# Altium project Time_Sampling_Oscilloscope.PrjPcb
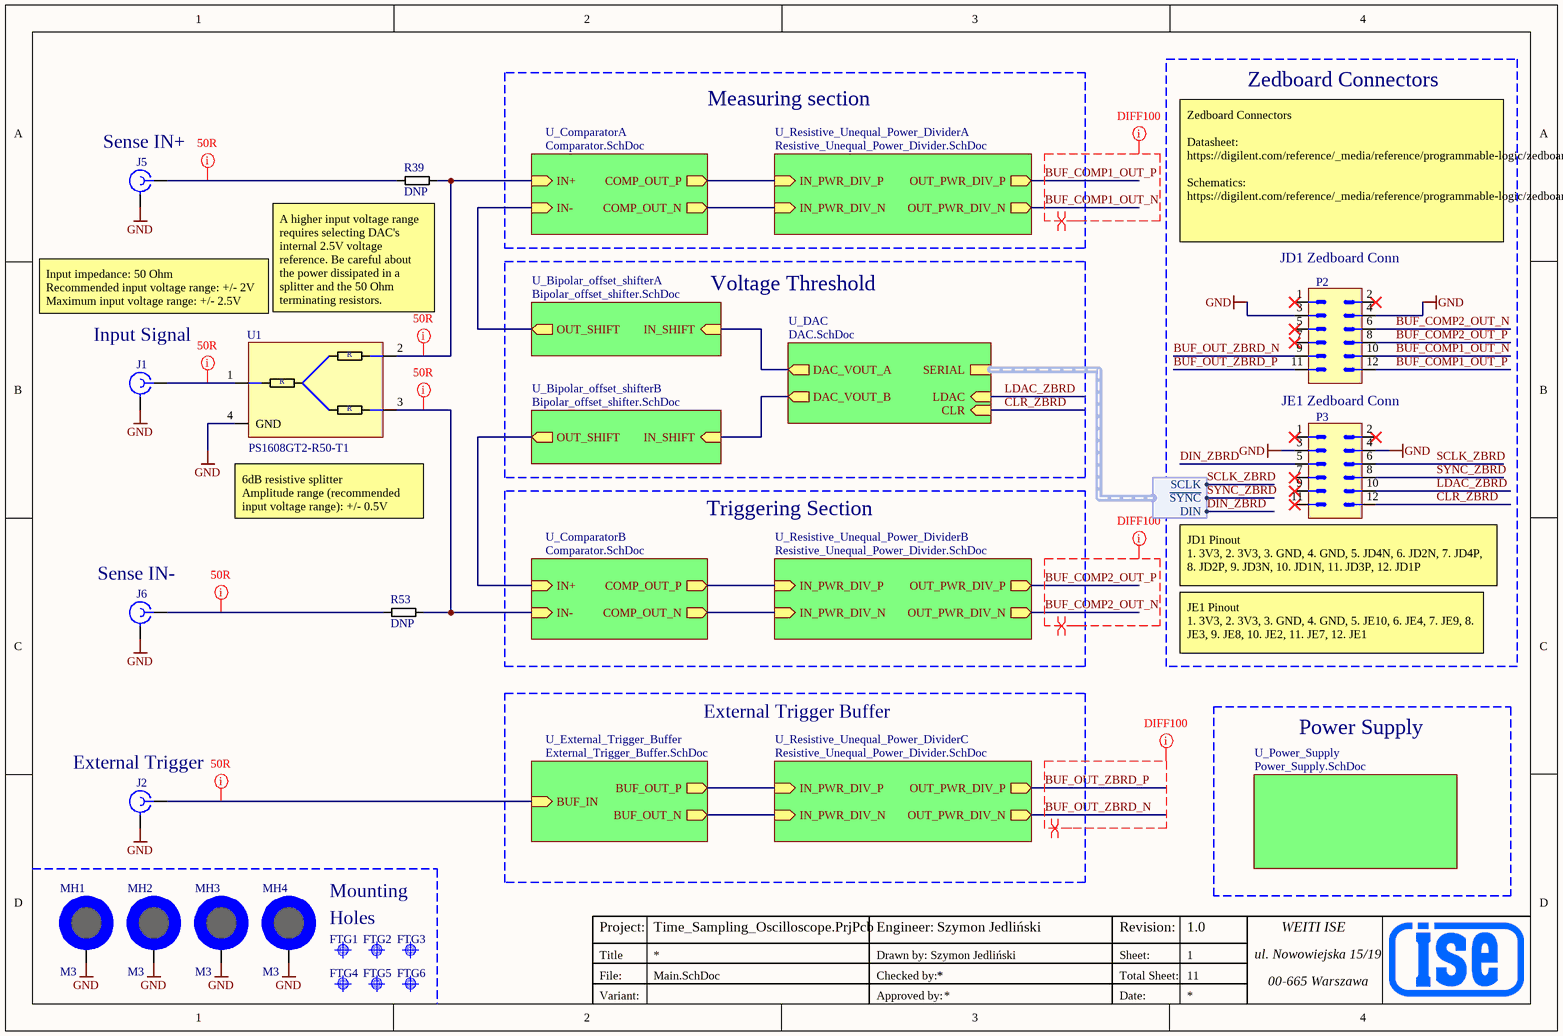
[diagram p0: Main.SchDoc]
11 sheets, 225 parts. Net scope: hierarchical (ports join the sheet entries above them; power ports are global).
Board file: PCB.PcbDoc
Sheets:
  Main.SchDoc
    U_ComparatorA = Comparator.SchDoc
    U_ComparatorB = Comparator.SchDoc
    U_Power_Supply = Power_Supply.SchDoc
      U_Power_P2V5 = Power_P2V5.SchDoc
      U_Power_N2V5 = Power_N2V5.SchDoc
      U_Power_P3V3 = Power_P3V3.SchDoc
      U_Power_VREF_P1V25 = Power_VREF_P1V25.SchDoc
    U_DAC = DAC.SchDoc
    U_External_Trigger_Buffer = External_Trigger_Buffer.SchDoc
    U_Bipolar_offset_shifterA = Bipolar_Offset_Shifter.SchDoc
    U_Bipolar_offset_shifterB = Bipolar_Offset_Shifter.SchDoc
    U_Resistive_Unequal_Power_DividerB = Resistive_Unequal_Power_Divider.SchDoc
    U_Resistive_Unequal_Power_DividerA = Resistive_Unequal_Power_Divider.SchDoc
    U_Resistive_Unequal_Power_DividerC = Resistive_Unequal_Power_Divider.SchDoc

## Sheet Main.SchDoc
size A4; CompanyName: WEITI ISE; Address1: ul. Nowowiejska 15/19; Address2: 00-665 Warszawa; DocumentNumber: 1; SheetNumber: 1; SheetTotal: 11

### Parts
FTG1  Fiducial  [FIDUCIAL_TOP_S100-200]  (value not drawn)  (no BOM)
FTG2  Fiducial  [FIDUCIAL_TOP_S100-200]  (value not drawn)  (no BOM)
FTG3  Fiducial  [FIDUCIAL_TOP_S100-200]  (value not drawn)  (no BOM)
FTG4  Fiducial  [FIDUCIAL_BOT_S100-200]  (value not drawn)  (no BOM)
FTG5  Fiducial  [FIDUCIAL_BOT_S100-200]  (value not drawn)  (no BOM)
FTG6  Fiducial  [FIDUCIAL_BOT_S100-200]  (value not drawn)  (no BOM)
J1  CONSMA020.062-G  [CONSMA020.062-G]  (value not drawn)
J2  CONSMA020.062-G  [CONSMA020.062-G]  (value not drawn)
J5  CONSMA020.062-G  [CONSMA020.062-G]  (value not drawn)
J6  CONSMA020.062-G  [CONSMA020.062-G]  (value not drawn)
MH1  M3  [MH-M3_COPPER]  (no BOM)
MH2  M3  [MH-M3_COPPER]  (no BOM)
MH3  M3  [MH-M3_COPPER]  (no BOM)
MH4  M3  [MH-M3_COPPER]  (no BOM)
P2  WURTH_610112249121  [WURTH_610112249121]  (value not drawn)
P3  WURTH_610112249121  [WURTH_610112249121]  (value not drawn)
R39  DNP  [RESC0402X40N]
R53  DNP  [RESC0402X40N]
U1  PS1608GT2-R50-T1  [PS1608GT2R50T1]

### Blocks framed on the sheet
Zedboard Connectors: P2 P3

### Sub-sheets
U_Bipolar_offset_shifterA = Bipolar_offset_shifter.SchDoc: OUT_SHIFT (out), IN_SHIFT (in)
U_Bipolar_offset_shifterB = Bipolar_offset_shifter.SchDoc: OUT_SHIFT (out), IN_SHIFT (in)
U_ComparatorA = Comparator.SchDoc: IN+ (in), IN- (in), COMP_OUT_P (out), COMP_OUT_N (out)
U_ComparatorB = Comparator.SchDoc: IN- (in), IN+ (in), COMP_OUT_P (out), COMP_OUT_N (out)
U_DAC = DAC.SchDoc: SERIAL (harness SERIAL_DAC), LDAC (in), CLR (in), DAC_VOUT_A (out), DAC_VOUT_B (out)
U_External_Trigger_Buffer = External_Trigger_Buffer.SchDoc: BUF_IN (in), BUF_OUT_P (out), BUF_OUT_N (out)
U_Power_Supply = Power_Supply.SchDoc: no entries
U_Resistive_Unequal_Power_DividerA = Resistive_Unequal_Power_Divider.SchDoc: IN_PWR_DIV_P (in), OUT_PWR_DIV_P (out), IN_PWR_DIV_N (in), OUT_PWR_DIV_N (out)
U_Resistive_Unequal_Power_DividerB = Resistive_Unequal_Power_Divider.SchDoc: IN_PWR_DIV_P (in), OUT_PWR_DIV_P (out), IN_PWR_DIV_N (in), OUT_PWR_DIV_N (out)
U_Resistive_Unequal_Power_DividerC = Resistive_Unequal_Power_Divider.SchDoc: IN_PWR_DIV_P (in), OUT_PWR_DIV_P (out), IN_PWR_DIV_N (in), OUT_PWR_DIV_N (out)

### Harnesses
SERIAL_DAC: DIN, SCLK, ~{SYNC}

### Nets
GND: J1.2 J2.2 J5.2 J6.2 MH1.MH MH2.MH MH3.MH MH4.MH P2.3 P2.4 P3.3 P3.4 U1.4(GND)
BUF_COMP1_OUT_N: P2.10 ; sheet U_Resistive_Unequal_Power_DividerA/OUT_PWR_DIV_N
BUF_COMP1_OUT_P: P2.12 ; sheet U_Resistive_Unequal_Power_DividerA/OUT_PWR_DIV_P
BUF_COMP2_OUT_N: P2.6 ; sheet U_Resistive_Unequal_Power_DividerB/OUT_PWR_DIV_N
BUF_COMP2_OUT_P: P2.8 ; sheet U_Resistive_Unequal_Power_DividerB/OUT_PWR_DIV_P
BUF_IN: J2.1 ; sheet U_External_Trigger_Buffer/BUF_IN
BUF_OUT_N: sheet U_External_Trigger_Buffer/BUF_OUT_N, sheet U_Resistive_Unequal_Power_DividerC/IN_PWR_DIV_N
BUF_OUT_P: sheet U_External_Trigger_Buffer/BUF_OUT_P, sheet U_Resistive_Unequal_Power_DividerC/IN_PWR_DIV_P
BUF_OUT_ZBRD_N: P2.9 ; sheet U_Resistive_Unequal_Power_DividerC/OUT_PWR_DIV_N
BUF_OUT_ZBRD_P: P2.11 ; sheet U_Resistive_Unequal_Power_DividerC/OUT_PWR_DIV_P
CLR_ZBRD: P3.12 ; sheet U_DAC/CLR
COMP_OUT_N: sheet U_ComparatorA/COMP_OUT_N, sheet U_Resistive_Unequal_Power_DividerA/IN_PWR_DIV_N
COMP_OUT_N: sheet U_ComparatorB/COMP_OUT_N, sheet U_Resistive_Unequal_Power_DividerB/IN_PWR_DIV_N  [a separate net that carries the same name]
COMP_OUT_P: sheet U_ComparatorA/COMP_OUT_P, sheet U_Resistive_Unequal_Power_DividerA/IN_PWR_DIV_P
COMP_OUT_P: sheet U_ComparatorB/COMP_OUT_P, sheet U_Resistive_Unequal_Power_DividerB/IN_PWR_DIV_P  [a separate net that carries the same name]
DAC_VOUT_A: sheet U_DAC/DAC_VOUT_A, sheet U_Bipolar_offset_shifterA/IN_SHIFT
DAC_VOUT_B: sheet U_DAC/DAC_VOUT_B, sheet U_Bipolar_offset_shifterB/IN_SHIFT
DIN_ZBRD: P3.5 ; sheet U_DAC/SERIAL.DIN
IN+: R39.1 U1.2 ; sheet U_ComparatorA/IN+
IN+: sheet U_ComparatorB/IN+, sheet U_Bipolar_offset_shifterB/OUT_SHIFT  [a separate net that carries the same name]
IN-: R53.2 U1.3 ; sheet U_ComparatorB/IN-
IN-: sheet U_ComparatorA/IN-, sheet U_Bipolar_offset_shifterA/OUT_SHIFT  [a separate net that carries the same name]
LDAC_ZBRD: P3.10 ; sheet U_DAC/LDAC
SCLK_ZBRD: P3.6 ; sheet U_DAC/SERIAL.SCLK
SYNC_ZBRD: P3.8 ; sheet U_DAC/SERIAL.~{SYNC}
NetJ1_1: J1.1 U1.1
NetJ5_1: J5.1 R39.2
NetJ6_1: J6.1 R53.1

Not connected (* = marked no-connect by the designer): P2 1* 2* 5* 7*; P3 1* 2* 7* 9* 11*

### Layout directives
net class SE50; CompClassName: SE50_LINE: BUF_IN, IN+, IN-, NetJ1_1, NetJ5_1, NetJ6_1
mark named DIFF100: BUF_COMP1_OUT_N, BUF_COMP1_OUT_P, BUF_COMP2_OUT_N, BUF_COMP2_OUT_P, BUF_OUT_ZBRD_N, BUF_OUT_ZBRD_P
differential pair; differential pair class DIFF100_LINES; net class DIFF100: BUF_COMP1_OUT_N, BUF_COMP1_OUT_P, BUF_COMP2_OUT_N, BUF_COMP2_OUT_P, BUF_OUT_ZBRD_N, BUF_OUT_ZBRD_P

### Notes on the sheet
- Measuring section
- (near J5) Sense IN+
- Zedboard Connectors
  Datasheet:
  https://digilent.com/reference/_media/reference/programmable-logic/zedboard/zedboard_ug.pdf
  Schematics:
  https://digilent.com/reference/_media/reference/programmable-logic/zedboard/zedboard_sch.pdf
- Input impedance: 50 Ohm
  Recommended input voltage range: +/- 2V
  Maximum input voltage range: +/- 2.5V
- (near R39) A higher input voltage range requires selecting DAC's internal 2.5V voltage reference. Be careful about the power dissipated in a splitter and the 50 Ohm terminating resistors.
- Voltage Threshold
- (near P2) JD1 Zedboard Conn
- Input Signal
- JE1 Zedboard Conn
- (near U1) 6dB resistive splitter
  Amplitude range (recommended input voltage range): +/- 0.5V
- Triggering Section
- (near J6) Sense IN-
- (near P3) JD1 Pinout
  1. 3V3, 2. 3V3, 3. GND, 4. GND, 5. JD4N, 6. JD2N, 7. JD4P, 8. JD2P, 9. JD3N, 10. JD1N, 11. JD3P, 12. JD1P
- JE1 Pinout
  1. 3V3, 2. 3V3, 3. GND, 4. GND, 5. JE10, 6. JE4, 7. JE9, 8. JE3, 9. JE8, 10. JE2, 11. JE7, 12. JE1
- External Trigger Buffer
- (near J2) External Trigger
- Power Supply
- Mounting
- Holes
- Project:
- Title
- File:
- Drawn by:
- Engineer:
- Checked by:
- Szymon Jedliński
- Sheet:
- Revision:
- Total Sheet:
- 1.0
- Variant:
- Approved by:
- Date:
- (in symbol PS1608GT2-R50-T1) R

### Library data of the parts
FTG1-FTG3 = FIDUCIAL_TOP_S100-200: Square Fiducial Target, Top Layer, 1.0mm, Top Solder 2.0mm, Keepout =2.0mm; DesignItemId: FIDUCIAL_TOP_S100-200; Family: Fiducial; Part Description: Square Fiducial Target, Top Layer, 1.0mm, Top Solder 2.0mm, Keepout =2.0mm
FTG4-FTG6 = FIDUCIAL_BOT_S100-200: Square Fiducial Target, Bot Layer, 1.0mm, Bot Solder 2.0mm, Keepout =2.0mm; DesignItemId: FIDUCIAL_BOT_S100-200; Family: Fiducial; Part Description: Square Fiducial Target, Bot Layer, 1.0mm, Bot Solder 2.0mm, Keepout =2.0mm
J1 J2 J5 J6 = CONSMA020.062-G: Coaxial Connectors SMA, Edge Mount, Female Receptacle, 0.062" PCB Mount, Gold; Manufacturer 1 Component Height: 7.92mm; DesignItemId: CONSMA020.062-G; HelpURL: https://www.mouser.pl/datasheet/2/418/9/ENG_DS_L9000279_01_A-3238972.pdf; Manufacturer Part Number: CONSMA020.062-G; SMD: Yes
MH1-MH4 = MH-M3_C: Mounting hole, M3, exposed pad; DesignItemId: MH-M3_C; Family: M3; Part Description: Mounting hole, M3, exposed pad
P2 P3 = WURTH_610112249121: WR-PHD SMT Angled Dual Pin Header, 2.54mm, 2x6; Manufacturer 1 Component Height: 5.23mm; DesignItemId: WURTH_610112249121; HelpURL: https://www.we-online.com/components/products/datasheet/610112249121.pdf; Manufacturer Part Number: WURTH_610112249121; SMD: Yes
R39 R53 = R0402_DNP: General Purpose Thick Film Chip Resistor; Manufacturer 1 Component Height: 0.4mm; Voltage: 50V; DesignItemId: R0402_DNP; HelpURL: https://www.vishay.com/docs/20035/dcrcwe3.pdf; SMD: Yes; Value: DNP
U1 = PS1608GT2-R50-T1: Signal Conditioning 50 ohm 2 terminal Power Splitter; Manufacturer 1 Component Height: 0.5mm; DesignItemId: PS1608GT2-R50-T1; HelpURL: https://www.mouser.pl/datasheet/2/392/n_catalog_partition31_en-1660522.pdf; Manufacturer Part Number: PS1608GT2-R50-T1; SMD: Yes; Value: PS1608GT2-R50-T1

## Sheet Comparator.SchDoc
size A4; CompanyName: WEITI ISE; Address1: ul. Nowowiejska 15/19; Address2: 00-665 Warszawa; DocumentNumber: 2; SheetNumber: 2; SheetTotal: 11
Used 2 times, as channels U_ComparatorA, U_ComparatorB. Parts and nets are listed once, with the designators drawn on the sheet.
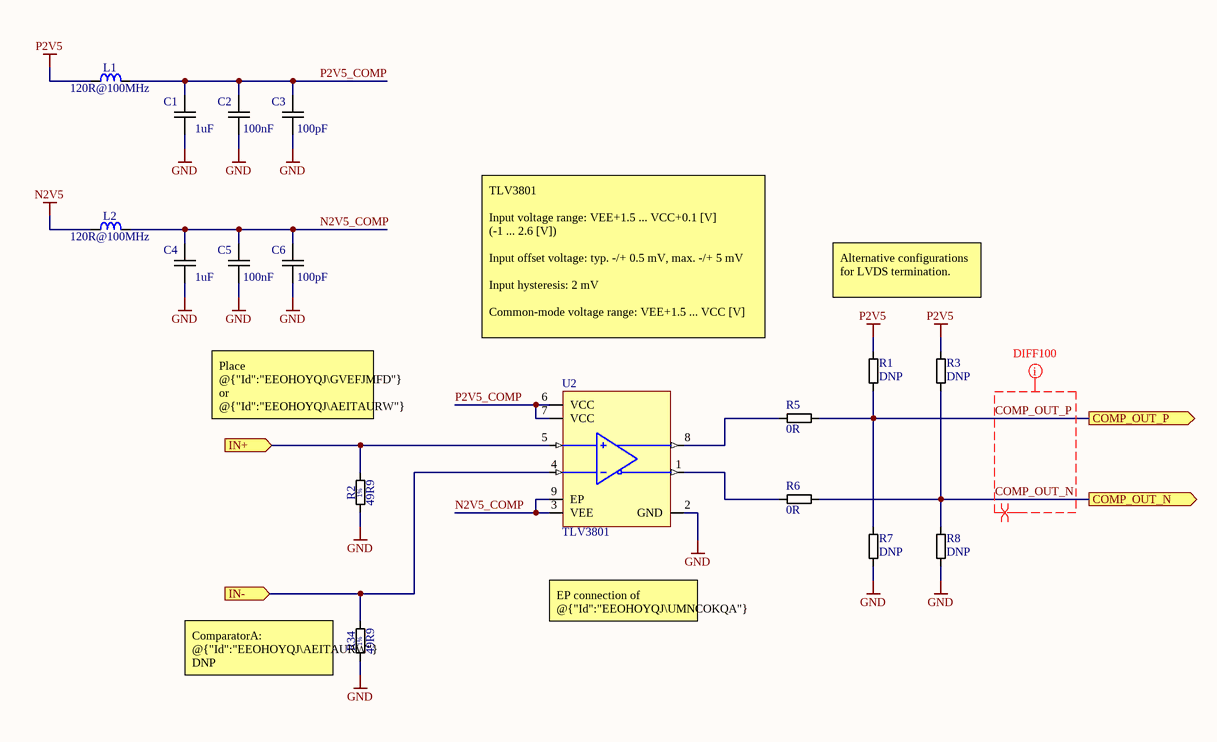
[diagram p1: Comparator.SchDoc]

### Parts
C1  1uF  [CAPC0603X90N]
C2  100nF  [CAPC0603X90N]
C3  100pF  [CAPC0603X90N]
C4  1uF  [CAPC0603X90N]
C5  100nF  [CAPC0603X90N]
C6  100pF  [CAPC0603X90N]
L1  120R@100MHz  [INDC0603X90N]
L2  120R@100MHz  [INDC0603X90N]
R1  DNP  [RESC0402X40N]
R2  49R9  [RESC0402X40N]
R3  DNP  [RESC0402X40N]
R5  0R  [RESC0402X40N]
R6  0R  [RESC0402X40N]
R7  DNP  [RESC0402X40N]
R8  DNP  [RESC0402X40N]
R34  49R9  [RESC0402X40N]
U2  TLV3801  [WSON50P200X200X80-9N]

### Ports
COMP_OUT_N (out), COMP_OUT_P (out), IN+ (in), IN- (in)

### Nets
GND: C1.2 C2.2 C3.2 C4.2 C5.2 C6.2 R2.1 R7.1 R8.1 R34.1 U2.2(GND)
N2V5: L2.1
P2V5: L1.1 R1.2 R3.2
COMP_OUT_N: R3.1 R6.2 R8.2 ; port COMP_OUT_N
COMP_OUT_P: R1.1 R5.2 R7.2 ; port COMP_OUT_P
IN+: R2.2 U2.5(IN+) ; port IN+
IN-: R34.2 U2.4(IN-) ; port IN-
N2V5_COMP: C4.1 C5.1 C6.1 L2.2 U2.3(VEE) U2.9(EP)
P2V5_COMP: C1.1 C2.1 C3.1 L1.2 U2.6(VCC) U2.7(VCC)
NetR5_1: R5.1 U2.8(OUT+)
NetR6_1: R6.1 U2.1(OUT-)

### Channels
U_ComparatorA: designators end in _1; ports COMP_OUT_N=COMP_OUT_N COMP_OUT_P=COMP_OUT_P IN+=IN+ IN-=IN-
U_ComparatorB: designators end in _2; ports COMP_OUT_N=COMP_OUT_N COMP_OUT_P=COMP_OUT_P IN+=IN+ IN-=IN-

### Layout directives
mark named DIFF100: COMP_OUT_N, COMP_OUT_P
differential pair; differential pair class DIFF100_LINES; net class DIFF100: COMP_OUT_N, COMP_OUT_P

### Notes on the sheet
- TLV3801
  Input voltage range: VEE+1.5 ... VCC+0.1 [V]
  (-1 ... 2.6 [V])
  Input offset voltage: typ. -/+ 0.5 mV, max. -/+ 5 mV
  Input hysteresis: 2 mV
  Common-mode voltage range: VEE+1.5 ... VCC [V]
- Alternative configurations for LVDS termination.
- Place @{"Id":"EEOHOYQJ\GVEFJMFD"} or @{"Id":"EEOHOYQJ\AEITAURW"} resistors as close as possible to the input pin of TLV3801
- (near R34) ComparatorA: @{"Id":"EEOHOYQJ\AEITAURW"} DNP
  ComparatorB: @{"Id":"EEOHOYQJ\GVEFJMFD"} DNP
- EP connection of @{"Id":"EEOHOYQJ\UMNCOKQA"} verified with TI support.
- Project:
- Title
- File:
- Drawn by:
- Engineer:
- Checked by:
- Szymon Jedliński
- Sheet:
- Revision:
- Total Sheet:
- 1.0
- Variant:
- Approved by:
- Date:

### Library data of the parts
C1 C4 = CC0603_1UF_16V_10%_X7R: Non-polarised capacitor; Manufacturer Part Number: CL10B105KO8NNNC; DesignItemId: CC0603_1UF_16V_10%_X7R; HelpURL: https://www.mouser.pl/datasheet/2/585/MLCC-1837944.pdf; Height: 0.8mm; SMD: Yes; Value: 1uF
C2 C5 = CC0603_100NF_16V_10%_X7R: Non-polarised capacitor; Manufacturer Part Number: VJ0603Y104KXJCW1BC; DesignItemId: CC0603_100NF_16V_10%_X7R; HelpURL: https://www.vishay.com/docs/28548/vjw1bcbascomseries.pdf; Height: 0.8mm; SMD: Yes; Value: 100nF
C3 C6 = CC0603_100PF_50V_5%_X7R: Non-polarised capacitor; Manufacturer Part Number: 06035C101JAT2A; DesignItemId: CC0603_100PF_50V_5%_X7R; HelpURL: https://www.mouser.pl/datasheet/2/40/KGM_X7R-3223212.pdf; Height: 0.8mm; SMD: Yes; Value: 100pF
L1 L2 = FB0603_120R@100MHZ_2A: Ferrite Bead; Manufacturer Part Number: BLM18PG121SN1D; Manufacturer 1 Component Height: 0.8mm; Tolerance: 25%; DesignItemId: FB0603_120R@100MHZ_2A; HelpURL: https://www.tme.eu/Document/19a35c43258593752611d1c31a7dbf1a/MURATA-BLM18P.pdf; SMD: Yes; Value: 120R@100MHz
R1 R3 R7 R8 = R0402_DNP: as R39 on sheet Main; DesignItemId: R0402_DNP; HelpURL: https://www.vishay.com/docs/20035/dcrcwe3.pdf; SMD: Yes; Value: DNP
R2 R34 = R0402_49R9_0.0625W_100PPM: General Purpose Thick Film Chip Resistor; Manufacturer Part Number: RC0402FR-0749R9L; Manufacturer 1 Component Height: 0.4mm; Tolerance: 1%; Voltage: 50V; DesignItemId: R0402_49R9_0.0625W_100PPM; HelpURL: https://www.mouser.pl/datasheet/2/447/PYu_RC_Group_51_RoHS_L_11-1984063.pdf; SMD: Yes; Value: 49R9
R5 R6 = R0402_0R_JUMPER: General Purpose Thick Film Chip Resistor; Manufacturer Part Number: CRCW04020000Z0EDC; Manufacturer 1 Component Height: 0.4mm; Tolerance: 20mOhm; Voltage: 50V; DesignItemId: R0402_0R_JUMPER; HelpURL: https://www.vishay.com/docs/20035/dcrcwe3.pdf; SMD: Yes; Value: 0R
U2 = TLV3801: 225-ps High-Speed Comparator with LVDS Outputs; Manufacturer Part Number: TLV3801DSG(_); Manufacturer 1 Component Height: 0.8mm; Supplier 1: Mouser; Supplier Part Number 1: 595-TLV3801DSGR; Supplier 2: Mouser; Supplier Part Number 2: 595-TLV3801DSGT; DesignItemId: TLV3801; Device: TLV3801; HelpURL: https://www.ti.com/lit/ds/symlink/tlv3801.pdf?ts=1690237794912; SMD: Yes

## Sheet Power_Supply.SchDoc
size A4; CompanyName: WEITI ISE; Address1: ul. Nowowiejska 15/19; Address2: 00-665 Warszawa; DocumentNumber: 7; SheetNumber: 7; SheetTotal: 11
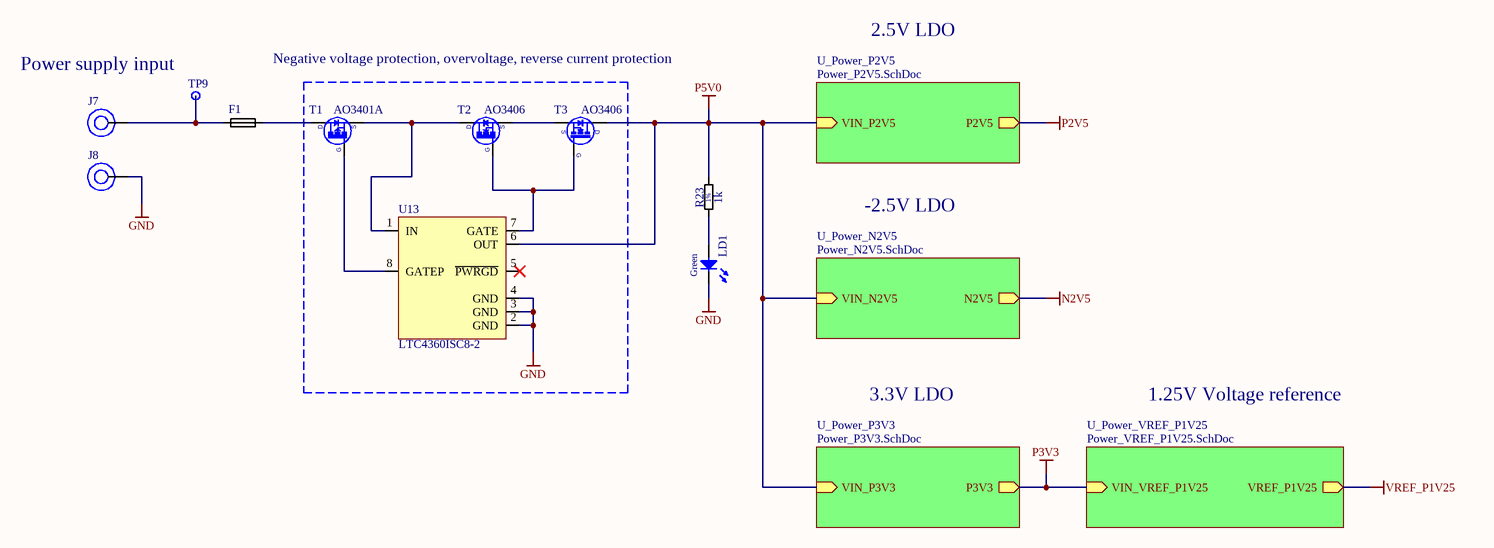
[diagram p2: Power_Supply.SchDoc]

### Parts
F1  C1Q 1.5  [FUSE1206]  (value not drawn)
J7  571-0500  [5710500-Deltron]  (value not drawn)
J8  571-0100  [5710100-Deltron]  (value not drawn)
LD1  Green  [LED_0603X60N]
R23  1k  [RESC0603X60N]
T1  AO3401A  [SOT23-3]
T2  AO3406  [SOT23-3]
T3  AO3406  [SOT23-3]
TP9  TestPoint  [TESTPOINT_SMD_C1P27MM]  (value not drawn)  (no BOM)
U13  LTC4360ISC8-2  [SC70-8]

### Sub-sheets
U_Power_N2V5 = Power_N2V5.SchDoc: N2V5 (out), VIN_N2V5 (in)
U_Power_P2V5 = Power_P2V5.SchDoc: P2V5 (out), VIN_P2V5 (in)
U_Power_P3V3 = Power_P3V3.SchDoc: P3V3 (out), VIN_P3V3 (in)
U_Power_VREF_P1V25 = Power_VREF_P1V25.SchDoc: VREF_P1V25 (out), VIN_VREF_P1V25 (in)

### Nets
GND: J8.1 LD1.1(C) U13.2(GND) U13.3(GND) U13.4(GND)
P3V3: sheet U_Power_P3V3/P3V3, sheet U_Power_VREF_P1V25/VIN_VREF_P1V25
P5V0: R23.2 T3.3(D) U13.6(OUT) ; sheet U_Power_P2V5/VIN_P2V5, sheet U_Power_N2V5/VIN_N2V5, sheet U_Power_P3V3/VIN_P3V3
NetF1_1: F1.1 J7.1 TP9.1
NetF1_2: F1.2 T1.3(D)
NetLD1_2: LD1.2(A) R23.1
NetT1_1: T1.1(G) U13.8(GATEP)
NetT1_2: T1.2(S) T2.3(D) U13.1(IN)
NetT2_1: T2.1(G) T3.1(G) U13.7(GATE)
NetT2_2: T2.2(S) T3.2(S)

Not connected (* = marked no-connect by the designer): U13 5(~{PWRGD})*

### Notes on the sheet
- 2.5V LDO
- (near TP9) Power supply input
- Negative voltage protection, overvoltage, reverse current protection
- -2.5V LDO
- 3.3V LDO
- 1.25V Voltage reference
- Project:
- Title
- File:
- Drawn by:
- Engineer:
- Checked by:
- Szymon Jedliński
- Sheet:
- Revision:
- Total Sheet:
- 1.0
- Variant:
- Approved by:
- Date:

### Library data of the parts
F1 = C1Q 1: Fuse; Very Fast Acting; 1.5A; 125VAC, 63VDC; SMD;; Manufacturer 1 Component Height: 0.58mm; Voltage_rating: 125VAC/63VDC; Fuse type: Ceramic; Breaking capacity: 50A; Current_rating: 1.5A; DesignItemId: C1Q 1; Device: C1Q 1.5; HelpURL: https://www.mouser.pl/datasheet/2/643/ds-CP-c1q-series-1313102.pdf; Manufacturer Part Number: C1Q 1.5; SMD: Yes
J7 = 571-0500: 4mm Jack 90deg PCB Mounted Insulated Socket Red; Manufacturer 1 Component Height: 12.4mm; DesignItemId: 571-0500; Footprint: 571-0500; HelpURL: https://www.mouser.pl/datasheet/2/458/deltron-571-0500-4mm-90deg-single-socket-data-372654.pdf; Manufacturer Part Number: 571-0500; SMD: No
J8 = 571-0100: 4mm Jack 90deg PCB Mounted Insulated Socket Black; Manufacturer 1 Component Height: 12.4mm; DesignItemId: 571-0100; Footprint: 571-0100; HelpURL: https://www.mouser.pl/datasheet/2/458/deltron-571-0500-4mm-90deg-single-socket-data-372654.pdf; Manufacturer Part Number: 571-0100; SMD: No
LD1 = LED_0603_V_GREEN: SMD mono-color Chip LED, Green, 0603; Manufacturer Part Number: HSME-C191; Manufacturer 1 Component Height: 0.6mm; DesignItemId: LED_0603_V_GREEN; Color: Green; HelpURL: https://www.tme.eu/Document/898384df4a59fb78dfee2d27c6573b7a/HSME-C191.pdf; SMD: Yes
R23 = R0603_1K_0.1W_100PPM: General Purpose Thick Film Chip Resistor; Manufacturer Part Number: CQ03SAF1001T5E; Manufacturer 1 Component Height: 0.5mm; Tolerance: 1%; Voltage: 75V; DesignItemId: R0603_1K_0.1W_100PPM; SMD: Yes; Value: 1k
T1 = AO3401A: 30V P-Channel MOSFET; Manufacturer 1 Component Height: 1.05mm; DesignItemId: AO3401A; Device: AO3401A; HelpURL: https://www.tme.eu/Document/d25b071532a0a1e329733a03427696ee/AO3401A-DTE.pdf; Manufacturer Part Number: AO3401A; SMD: Yes
T2 T3 = AO3406: Transistor: N-MOSFET; unipolar; 30V; 2.9A; 0.9W; SOT23; Manufacturer 1 Component Height: 1.05mm; DesignItemId: AO3406; Device: AO3406; HelpURL: https://www.tme.eu/Document/0f7dd37f1878b91445c27729186942d7/AO3406.pdf; Manufacturer Part Number: AO3406; SMD: Yes
TP9 = TESTPOINT_SMD_C1P27MM: 1.27mm diameter SMD Test Point Area; DesignItemId: TESTPOINT_SMD_C1P27MM; Family: TestPoint; Part Description: 1.27mm diameter SMD Test Point Area
U13 = LTC4360ISC8-2: Overvoltage Protection Controller, 2.5V to 5.5V Operation, Reverse Voltage Protection; Manufacturer Part Number: LTC4360ISC8-2#TRMPBF; Manufacturer 1 Component Height: 1mm; DesignItemId: LTC4360ISC8-2; Device: LTC4360ISC8-2; HelpURL: https://www.analog.com/media/en/technical-documentation/data-sheets/LTC4360-1-4360-2.pdf; SMD: Yes

## Sheet Power_P2V5.SchDoc
size A4; CompanyName: WEITI ISE; Address1: ul. Nowowiejska 15/19; Address2: 00-665 Warszawa; DocumentNumber: 8; SheetNumber: 8; SheetTotal: 11
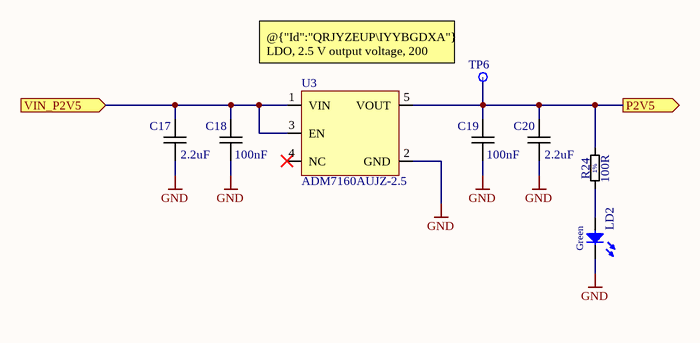
[diagram p3: Power_P2V5.SchDoc]

### Parts
C17  2.2uF  [CAPC0603X90N]
C18  100nF  [CAPC0603X90N]
C19  100nF  [CAPC0603X90N]
C20  2.2uF  [CAPC0603X90N]
LD2  Green  [LED_0603X60N]
R24  100R  [RESC0603X60N]
TP6  TestPoint  [TESTPOINT_SMD_C1P27MM]  (value not drawn)  (no BOM)
U3  ADM7160AUJZ-2.5  [SOT23-5]

### Ports
P2V5 (out), VIN_P2V5 (in)

### Nets
GND: C17.2 C18.2 C19.2 C20.2 LD2.1(C) U3.2(GND)
P2V5: C19.1 C20.1 R24.2 TP6.1 U3.5(VOUT) ; port P2V5
P5V0: C17.1 C18.1 U3.1(VIN) U3.3(EN) ; port VIN_P2V5
NetLD2_2: LD2.2(A) R24.1

Not connected (* = marked no-connect by the designer): U3 4(NC)*

### Notes on the sheet
- @{"Id":"QRJYZEUP\IYYBGDXA"} LDO, 2.5 V output voltage, 200 mA maximum output current
- Project:
- Title
- File:
- Drawn by:
- Engineer:
- Checked by:
- Szymon Jedliński
- Sheet:
- Revision:
- Total Sheet:
- 1.0
- Variant:
- Approved by:
- Date:

### Library data of the parts
C17 C20 = CC0603_2U2F_16V_10%_X7R: Non-polarised capacitor; Manufacturer Part Number: GRM188Z71C225KE43D; DesignItemId: CC0603_2U2F_16V_10%_X7R; HelpURL: https://www.mouser.pl/datasheet/2/281/1/GRM188Z71C225KE43_01A-1985990.pdf; Height: 0.8mm; SMD: Yes; Value: 2.2uF
C18 C19 = CC0603_100NF_16V_10%_X7R: as C2 on sheet Comparator; DesignItemId: CC0603_100NF_16V_10%_X7R; HelpURL: https://www.vishay.com/docs/28548/vjw1bcbascomseries.pdf; Height: 0.8mm; SMD: Yes; Value: 100nF
LD2 = LED_0603_V_GREEN: as LD1 on sheet Power_Supply; DesignItemId: LED_0603_V_GREEN; Color: Green; HelpURL: https://www.tme.eu/Document/898384df4a59fb78dfee2d27c6573b7a/HSME-C191.pdf; SMD: Yes
R24 = R0603_100R_0.1W_100PPM: General Purpose Thick Film Chip Resistor; Manufacturer Part Number: 0603SAF1000T5E; Manufacturer 1 Component Height: 0.5mm; Tolerance: 1%; Voltage: 50V; DesignItemId: R0603_100R_0.1W_100PPM; HelpURL: https://www.vishay.com/docs/20035/dcrcwe3.pdf; SMD: Yes; Value: 100R
TP6 = TESTPOINT_SMD_C1P27MM: 1.27mm diameter SMD Test Point Area; DesignItemId: TESTPOINT_SMD_C1P27MM; Family: TestPoint; Part Description: 1.27mm diameter SMD Test Point Area
U3 = ADM7160AUJZ-2.5: Ultralow Noise, 200 mA Linear Regulator, 2.5V out; Manufacturer 1 Component Height: 1mm; DesignItemId: ADM7160AUJZ-2.5; Device: ADM7160AUJZ-2.5; HelpURL: https://www.mouser.pl/datasheet/2/609/ADM7160-3120776.pdf; SMD: Yes

## Sheet Power_N2V5.SchDoc
size A4; CompanyName: WEITI ISE; Address1: ul. Nowowiejska 15/19; Address2: 00-665 Warszawa; DocumentNumber: 9; SheetNumber: 9; SheetTotal: 11
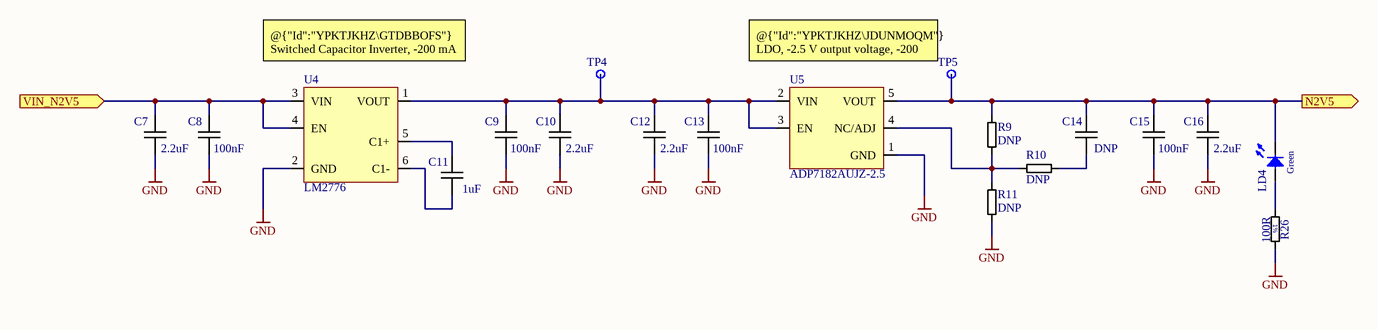
[diagram p4: Power_N2V5.SchDoc]

### Parts
C7  2.2uF  [CAPC0603X90N]
C8  100nF  [CAPC0603X90N]
C9  100nF  [CAPC0603X90N]
C10  2.2uF  [CAPC0603X90N]
C11  1uF  [CAPC0603X90N]
C12  2.2uF  [CAPC0603X90N]
C13  100nF  [CAPC0603X90N]
C14  DNP  [CAPC0603X90N]
C15  100nF  [CAPC0603X90N]
C16  2.2uF  [CAPC0603X90N]
LD4  Green  [LED_0603X60N]
R9  DNP  [RESC0402X40N]
R10  DNP  [RESC0402X40N]
R11  DNP  [RESC0402X40N]
R26  100R  [RESC0603X60N]
TP4  TestPoint  [TESTPOINT_SMD_C1P27MM]  (value not drawn)  (no BOM)
TP5  TestPoint  [TESTPOINT_SMD_C1P27MM]  (value not drawn)  (no BOM)
U4  LM2776  [SOT23-6]
U5  ADP7182AUJZ-2.5  [SOT23-5]

### Ports
N2V5 (out), VIN_N2V5 (in)

### Nets
GND: C7.2 C8.2 C9.2 C10.2 C12.2 C13.2 C15.2 C16.2 R11.1 R26.2 U4.2(GND) U5.1(GND)
N2V5: C14.1 C15.1 C16.1 LD4.1(C) R9.2 TP5.1 U5.5(VOUT) ; port N2V5
P5V0: C7.1 C8.1 U4.3(VIN) U4.4(EN) ; port VIN_N2V5
NetC9_1: C9.1 C10.1 C12.1 C13.1 TP4.1 U4.1(VOUT) U5.2(VIN) U5.3(EN)
NetC11_1: C11.1 U4.5(C1+)
NetC11_2: C11.2 U4.6(C1-)
NetC14_2: C14.2 R10.1
NetLD4_2: LD4.2(A) R26.1
NetR9_1: R9.1 R10.2 R11.2 U5.4(NC/ADJ)

### Notes on the sheet
- (near U4) @{"Id":"YPKTJKHZ\GTDBBOFS"} Switched Capacitor Inverter, -200 mA output current, Vout = -Vin
- (near TP5) @{"Id":"YPKTJKHZ\JDUNMOQM"} LDO, -2.5 V output voltage, -200 mA maximum output current
- Project:
- Title
- File:
- Drawn by:
- Engineer:
- Checked by:
- Szymon Jedliński
- Sheet:
- Revision:
- Total Sheet:
- 1.0
- Variant:
- Approved by:
- Date:

### Library data of the parts
C7 C10 C12 C16 = CC0603_2U2F_16V_10%_X7R: as C17 on sheet Power_P2V5; DesignItemId: CC0603_2U2F_16V_10%_X7R; HelpURL: https://www.mouser.pl/datasheet/2/281/1/GRM188Z71C225KE43_01A-1985990.pdf; Height: 0.8mm; SMD: Yes; Value: 2.2uF
C8 C9 C13 C15 = CC0603_100NF_16V_10%_X7R: as C2 on sheet Comparator; DesignItemId: CC0603_100NF_16V_10%_X7R; HelpURL: https://www.vishay.com/docs/28548/vjw1bcbascomseries.pdf; Height: 0.8mm; SMD: Yes; Value: 100nF
C11 = CC0603_1UF_16V_10%_X7R: as C1 on sheet Comparator; DesignItemId: CC0603_1UF_16V_10%_X7R; HelpURL: https://www.mouser.pl/datasheet/2/585/MLCC-1837944.pdf; Height: 0.8mm; SMD: Yes; Value: 1uF
C14 = CC0603_DNP: Non-polarised capacitor; Manufacturer Part Number: UNDEFINED; DesignItemId: CC0603_DNP; Height: 0.8mm; SMD: Yes; Value: DNP
LD4 = LED_0603_V_GREEN: as LD1 on sheet Power_Supply; DesignItemId: LED_0603_V_GREEN; Color: Green; HelpURL: https://www.tme.eu/Document/898384df4a59fb78dfee2d27c6573b7a/HSME-C191.pdf; SMD: Yes
R9-R11 = R0402_DNP: as R39 on sheet Main; DesignItemId: R0402_DNP; HelpURL: https://www.vishay.com/docs/20035/dcrcwe3.pdf; SMD: Yes; Value: DNP
R26 = R0603_100R_0.1W_100PPM: as R24 on sheet Power_P2V5; DesignItemId: R0603_100R_0.1W_100PPM; HelpURL: https://www.vishay.com/docs/20035/dcrcwe3.pdf; SMD: Yes; Value: 100R
TP4 TP5 = TESTPOINT_SMD_C1P27MM: 1.27mm diameter SMD Test Point Area; DesignItemId: TESTPOINT_SMD_C1P27MM; Family: TestPoint; Part Description: 1.27mm diameter SMD Test Point Area
U4 = LM2776: Switched Capacitor Inverter, Input Voltage: 2.7 V to 5.5 V, 200-mA Output Current; Manufacturer Part Number: LM2776DBV(_); Manufacturer 1 Component Height: 1.45mm; DesignItemId: LM2776; Device: LM2776; HelpURL: https://www.ti.com/lit/ds/symlink/lm2776.pdf; SMD: Yes
U5 = ADP7182AUJZ-2.5: LDO Voltage Regulators -30V, 200mA, low noise, Linear Reg, 2.5V; Manufacturer 1 Component Height: 1mm; DesignItemId: ADP7182AUJZ-2.5; Device: ADP7182AUJZ-2.5; HelpURL: https://www.mouser.pl/datasheet/2/609/ADP7182-3122091.pdf; Manufacturer Part Number: ADP7182AUJZ-2.5; SMD: Yes

## Sheet Power_P3V3.SchDoc
size A4; CompanyName: WEITI ISE; Address1: ul. Nowowiejska 15/19; Address2: 00-665 Warszawa; DocumentNumber: 10; SheetNumber: 10; SheetTotal: 11
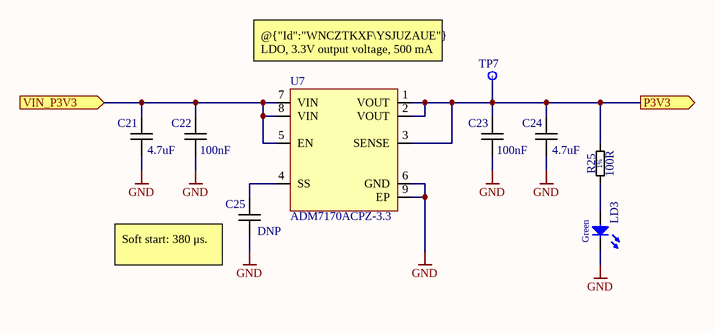
[diagram p5: Power_P3V3.SchDoc]

### Parts
C21  4.7uF  [CAPC0603X90N]
C22  100nF  [CAPC0603X90N]
C23  100nF  [CAPC0603X90N]
C24  4.7uF  [CAPC0603X90N]
C25  DNP  [CAPC0603X90N]
LD3  Green  [LED_0603X60N]
R25  100R  [RESC0603X60N]
TP7  TestPoint  [TESTPOINT_SMD_C1P27MM]  (value not drawn)  (no BOM)
U7  ADM7170ACPZ-3.3  [LFCSP50P300X300X80-9N-D]

### Ports
P3V3 (out), VIN_P3V3 (in)

### Nets
GND: C21.2 C22.2 C23.2 C24.2 C25.2 LD3.1(C) U7.6(GND) U7.9(EP)
P3V3: C23.1 C24.1 R25.2 TP7.1 U7.1(VOUT) U7.2(VOUT) U7.3(SENSE) ; port P3V3
P5V0: C21.1 C22.1 U7.5(EN) U7.7(VIN) U7.8(VIN) ; port VIN_P3V3
NetC25_1: C25.1 U7.4(SS)
NetLD3_2: LD3.2(A) R25.1

### Notes on the sheet
- @{"Id":"WNCZTKXF\YSJUZAUE"} LDO, 3.3V output voltage, 500 mA maximum output current
- (near C25) Soft start: 380 μs.
- Project:
- Title
- File:
- Drawn by:
- Engineer:
- Checked by:
- Szymon Jedliński
- Sheet:
- Revision:
- Total Sheet:
- 1.0
- Variant:
- Approved by:
- Date:

### Library data of the parts
C21 C24 = CC0603_4U7F_16V_10%_X7R: Non-polarised capacitor; Manufacturer Part Number: GRM188Z71C475KE21D; DesignItemId: CC0603_4U7F_16V_10%_X7R; HelpURL: https://www.mouser.pl/datasheet/2/281/1/GRM188Z71C225KE43_01A-1985990.pdf; Height: 0.8mm; SMD: Yes; Value: 4.7uF
C22 C23 = CC0603_100NF_16V_10%_X7R: as C2 on sheet Comparator; DesignItemId: CC0603_100NF_16V_10%_X7R; HelpURL: https://www.vishay.com/docs/28548/vjw1bcbascomseries.pdf; Height: 0.8mm; SMD: Yes; Value: 100nF
C25 = CC0603_DNP: as C14 on sheet Power_N2V5; DesignItemId: CC0603_DNP; Height: 0.8mm; SMD: Yes; Value: DNP
LD3 = LED_0603_V_GREEN: as LD1 on sheet Power_Supply; DesignItemId: LED_0603_V_GREEN; Color: Green; HelpURL: https://www.tme.eu/Document/898384df4a59fb78dfee2d27c6573b7a/HSME-C191.pdf; SMD: Yes
R25 = R0603_100R_0.1W_100PPM: as R24 on sheet Power_P2V5; DesignItemId: R0603_100R_0.1W_100PPM; HelpURL: https://www.vishay.com/docs/20035/dcrcwe3.pdf; SMD: Yes; Value: 100R
TP7 = TESTPOINT_SMD_C1P27MM: 1.27mm diameter SMD Test Point Area; DesignItemId: TESTPOINT_SMD_C1P27MM; Family: TestPoint; Part Description: 1.27mm diameter SMD Test Point Area
U7 = ADM7170ACPZ-3.3: 3.3V, 500 mA, Ultralow Noise, High PSRR,Fast Transient Response CMOS LDO, FIXED, LFCSP-8; Manufacturer Part Number: ADM7170ACPZ-3.3-R7; Manufacturer 1 Component Height: 0.8mm; DesignItemId: ADM7170ACPZ-3.3; Device: ADM7170ACPZ-3.3; HelpURL: https://www.analog.com/media/en/technical-documentation/data-sheets/ADM7170.pdf; SMD: Yes

## Sheet Power_VREF_P1V25.SchDoc
size A4; CompanyName: WEITI ISE; Address1: ul. Nowowiejska 15/19; Address2: 00-665 Warszawa; DocumentNumber: 11; SheetNumber: 11; SheetTotal: 11
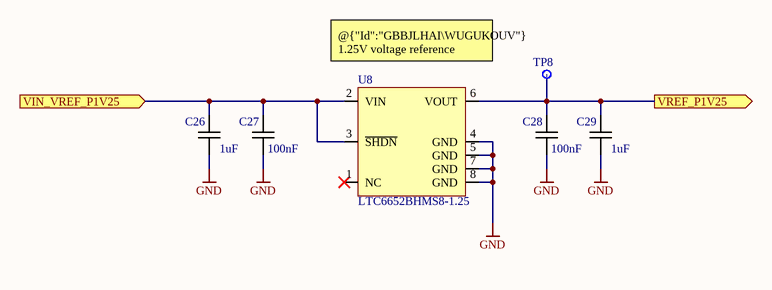
[diagram p6: Power_VREF_P1V25.SchDoc]

### Parts
C26  1uF  [CAPC0603X90N]
C27  100nF  [CAPC0603X90N]
C28  100nF  [CAPC0603X90N]
C29  1uF  [CAPC0603X90N]
TP8  TestPoint  [TESTPOINT_SMD_C1P27MM]  (value not drawn)  (no BOM)
U8  LTC6652BHMS8-1.25  [MSOP65P490X110-8N]

### Ports
VIN_VREF_P1V25 (in), VREF_P1V25 (out)

### Nets
GND: C26.2 C27.2 C28.2 C29.2 U8.4(GND) U8.5(GND) U8.7(GND) U8.8(GND)
P3V3: C26.1 C27.1 U8.2(VIN) U8.3(~{SHDN}) ; port VIN_VREF_P1V25
VREF_P1V25: C28.1 C29.1 TP8.1 U8.6(VOUT) ; port VREF_P1V25

Not connected (* = marked no-connect by the designer): U8 1(NC)*

### Notes on the sheet
- @{"Id":"GBBJLHAI\WUGUKOUV"} 1.25V voltage reference
- Project:
- Title
- File:
- Drawn by:
- Engineer:
- Checked by:
- Szymon Jedliński
- Sheet:
- Revision:
- Total Sheet:
- 1.0
- Variant:
- Approved by:
- Date:

### Library data of the parts
C26 C29 = CC0603_1UF_16V_10%_X7R: as C1 on sheet Comparator; DesignItemId: CC0603_1UF_16V_10%_X7R; HelpURL: https://www.mouser.pl/datasheet/2/585/MLCC-1837944.pdf; Height: 0.8mm; SMD: Yes; Value: 1uF
C27 C28 = CC0603_100NF_16V_10%_X7R: as C2 on sheet Comparator; DesignItemId: CC0603_100NF_16V_10%_X7R; HelpURL: https://www.vishay.com/docs/28548/vjw1bcbascomseries.pdf; Height: 0.8mm; SMD: Yes; Value: 100nF
TP8 = TESTPOINT_SMD_C1P27MM: 1.27mm diameter SMD Test Point Area; DesignItemId: TESTPOINT_SMD_C1P27MM; Family: TestPoint; Part Description: 1.27mm diameter SMD Test Point Area
U8 = LTC6652BHMS8-1.25: Precision Low Drift Low Noise Buffered Reference; Manufacturer Part Number: LTC6652BHMS8-1.25#PBF; Manufacturer 1 Component Height: 1.1mm; DesignItemId: LTC6652BHMS8-1.25; Device: LTC6652BHMS8-1.25; HelpURL: https://www.analog.com/media/en/technical-documentation/data-sheets/6652fg.pdf; SMD: Yes

## Sheet DAC.SchDoc
size A4; CompanyName: WEITI ISE; Address1: ul. Nowowiejska 15/19; Address2: 00-665 Warszawa; DocumentNumber: 3; SheetNumber: 3; SheetTotal: 11
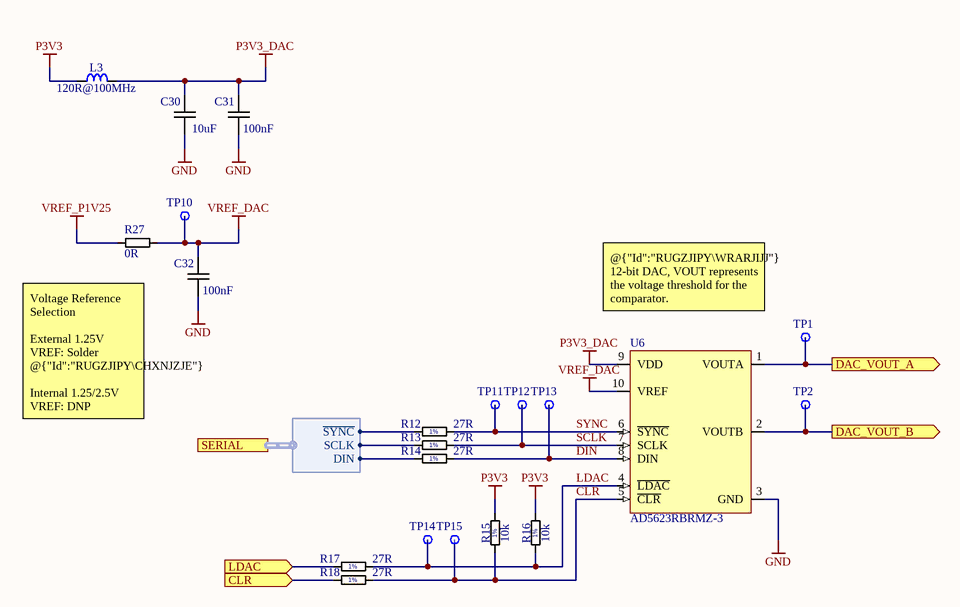
[diagram p7: DAC.SchDoc]

### Parts
C30  10uF  [CAPC0603X90N]
C31  100nF  [CAPC0603X90N]
C32  100nF  [CAPC0603X90N]
L3  120R@100MHz  [INDC0603X90N]
R12  27R  [RESC0603X60N]
R13  27R  [RESC0603X60N]
R14  27R  [RESC0603X60N]
R15  10k  [RESC0603X60N]
R16  10k  [RESC0603X60N]
R17  27R  [RESC0603X60N]
R18  27R  [RESC0603X60N]
R27  0R  [RESC0402X40N]
TP1  TestPoint  [TESTPOINT_SMD_C1P27MM]  (value not drawn)  (no BOM)
TP2  TestPoint  [TESTPOINT_SMD_C1P27MM]  (value not drawn)  (no BOM)
TP10  TestPoint  [TESTPOINT_SMD_C1P27MM]  (value not drawn)  (no BOM)
TP11  TestPoint  [TESTPOINT_SMD_C1P27MM]  (value not drawn)  (no BOM)
TP12  TestPoint  [TESTPOINT_SMD_C1P27MM]  (value not drawn)  (no BOM)
TP13  TestPoint  [TESTPOINT_SMD_C1P27MM]  (value not drawn)  (no BOM)
TP14  TestPoint  [TESTPOINT_SMD_C1P27MM]  (value not drawn)  (no BOM)
TP15  TestPoint  [TESTPOINT_SMD_C1P27MM]  (value not drawn)  (no BOM)
U6  AD5623RBRMZ-3  [MSOP50P490X110-10N]

### Ports
CLR (in), DAC_VOUT_A (out), DAC_VOUT_B (out), LDAC (in), SERIAL (harness SERIAL_DAC)

### Harnesses
SERIAL_DAC: DIN, SCLK, ~{SYNC}

### Nets
GND: C30.2 C31.2 C32.2 U6.3(GND)
P3V3: L3.1 R15.2 R16.2
P3V3_DAC: C30.1 C31.1 L3.2 U6.9(VDD)
VREF_DAC: C32.1 R27.2 TP10.1 U6.10(VREF)
VREF_P1V25: R27.1
CLR: R15.1 R18.2 TP15.1 U6.5(~{CLR})
CLR_ZBRD: R18.1 ; port CLR
DAC_VOUT_A: TP1.1 U6.1(VOUTA) ; port DAC_VOUT_A
DAC_VOUT_B: TP2.1 U6.2(VOUTB) ; port DAC_VOUT_B
DIN: R14.2 TP13.1 U6.8(DIN)
DIN_ZBRD: R14.1 ; port SERIAL.DIN
LDAC: R16.1 R17.2 TP14.1 U6.4(~{LDAC})
LDAC_ZBRD: R17.1 ; port LDAC
SCLK: R13.2 TP12.1 U6.7(SCLK)
SCLK_ZBRD: R13.1 ; port SERIAL.SCLK
SYNC: R12.2 TP11.1 U6.6(~{SYNC})
SYNC_ZBRD: R12.1 ; port SERIAL.~{SYNC}

### Notes on the sheet
- @{"Id":"RUGZJIPY\WRARJIJJ"} 12-bit DAC, VOUT represents the voltage threshold for the comparator.
- Voltage Reference Selection
  External 1.25V VREF: Solder @{"Id":"RUGZJIPY\CHXNJZJE"}
  Internal 1.25/2.5V VREF: DNP @{"Id":"RUGZJIPY\CHXNJZJE"}
- Project:
- Title
- File:
- Drawn by:
- Engineer:
- Checked by:
- Szymon Jedliński
- Sheet:
- Revision:
- Total Sheet:
- 1.0
- Variant:
- Approved by:
- Date:

### Library data of the parts
C30 = CC0603_10UF_25V_10%_X7R: Non-polarised capacitor; Manufacturer Part Number: GRM188R61E106KA73D; DesignItemId: CC0603_10UF_25V_10%_X7R; HelpURL: https://www.mouser.pl/datasheet/2/281/1/GRM188R61E106KA73_01A-1985831.pdf; Height: 0.8mm; SMD: Yes; Value: 10uF
C31 C32 = CC0603_100NF_16V_10%_X7R: as C2 on sheet Comparator; DesignItemId: CC0603_100NF_16V_10%_X7R; HelpURL: https://www.vishay.com/docs/28548/vjw1bcbascomseries.pdf; Height: 0.8mm; SMD: Yes; Value: 100nF
L3 = FB0603_120R@100MHZ_2A: as L1 on sheet Comparator; DesignItemId: FB0603_120R@100MHZ_2A; HelpURL: https://www.tme.eu/Document/19a35c43258593752611d1c31a7dbf1a/MURATA-BLM18P.pdf; SMD: Yes; Value: 120R@100MHz
R12-R14 R17 R18 = R0603_27R_0.1W_100PPM: General Purpose Thick Film Chip Resistor; Manufacturer Part Number: WF06P270JTL; Manufacturer 1 Component Height: 0.5mm; Tolerance: 1%; Voltage: 75V; DesignItemId: R0603_27R_0.1W_100PPM; HelpURL: https://www.vishay.com/docs/20035/dcrcwe3.pdf; SMD: Yes; Value: 27R
R15 R16 = R0603_10K_0.1W_100PPM: General Purpose Thick Film Chip Resistor; Manufacturer Part Number: CQ03SAF1002T5E; Manufacturer 1 Component Height: 0.5mm; Tolerance: 1%; Voltage: 75V; DesignItemId: R0603_10K_0.1W_100PPM; SMD: Yes; Value: 10k
R27 = R0402_0R_JUMPER: as R5 on sheet Comparator; DesignItemId: R0402_0R_JUMPER; HelpURL: https://www.vishay.com/docs/20035/dcrcwe3.pdf; SMD: Yes; Value: 0R
TP1 TP2 TP10-TP15 = TESTPOINT_SMD_C1P27MM: 1.27mm diameter SMD Test Point Area; DesignItemId: TESTPOINT_SMD_C1P27MM; Family: TestPoint; Part Description: 1.27mm diameter SMD Test Point Area
U6 = AD5623RBRMZ-3: AD5623RBRMZ-3, Dual 12-/14-/16-Bit nanoDAC with 5 ppm/°C On-Chip Reference, 10-Pin MSOP; Manufacturer 1 Component Height: 1.1mm; DesignItemId: AD5623RBRMZ-3; Device: AD5623RBRMZ-3; HelpURL: https://www.analog.com/media/en/technical-documentation/data-sheets/AD5623R_43R_63R.pdf; Manufacturer Part Number: AD5623RBRMZ-3; SMD: Yes

## Sheet External_Trigger_Buffer.SchDoc
size A4; CompanyName: WEITI ISE; Address1: ul. Nowowiejska 15/19; Address2: 00-665 Warszawa; DocumentNumber: 4; SheetNumber: 4; SheetTotal: 11
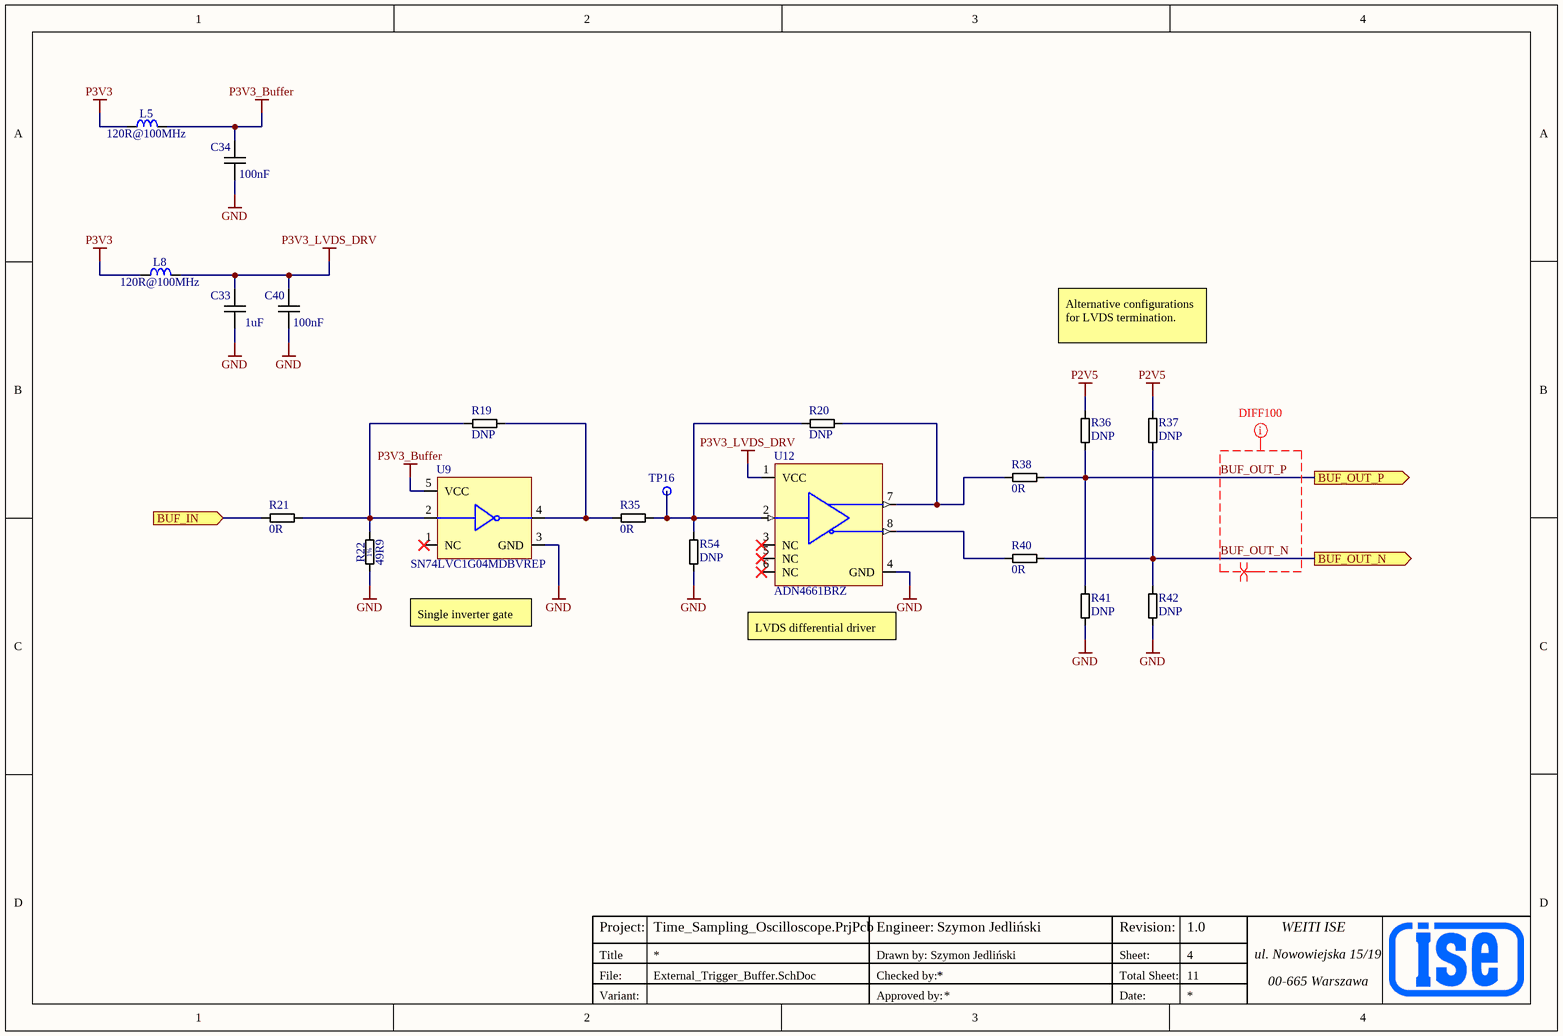
[diagram p8: External_Trigger_Buffer.SchDoc]

### Parts
C33  1uF  [CAPC0603X90N]
C34  100nF  [CAPC0603X90N]
C40  100nF  [CAPC0603X90N]
L5  120R@100MHz  [INDC0603X90N]
L8  120R@100MHz  [INDC0603X90N]
R19  DNP  [RESC0402X40N]
R20  DNP  [RESC0402X40N]
R21  0R  [RESC0402X40N]
R22  49R9  [RESC0402X40N]
R35  0R  [RESC0402X40N]
R36  DNP  [RESC0402X40N]
R37  DNP  [RESC0402X40N]
R38  0R  [RESC0402X40N]
R40  0R  [RESC0402X40N]
R41  DNP  [RESC0402X40N]
R42  DNP  [RESC0402X40N]
R54  DNP  [RESC0402X40N]
TP16  TestPoint  [TESTPOINT_SMD_C1P27MM]  (value not drawn)  (no BOM)
U9  SN74LVC1G04MDBVREP  [SOT23-5]
U12  ADN4661BRZ  [SOIC-8]

### Ports
BUF_IN (in), BUF_OUT_N (out), BUF_OUT_P (out)

### Nets
GND: C33.2 C34.2 C40.2 R22.1 R41.1 R42.1 R54.1 U9.3(GND) U12.4(GND)
P2V5: R36.2 R37.2
P3V3: L5.1 L8.1
P3V3_Buffer: C34.1 L5.2 U9.5(VCC)
P3V3_LVDS_DRV: C33.1 C40.1 L8.2 U12.1(VCC)
BUF_IN: R21.1 ; port BUF_IN
BUF_OUT_N: R37.1 R40.2 R42.2 ; port BUF_OUT_N
BUF_OUT_P: R36.1 R38.2 R41.2 ; port BUF_OUT_P
NetR19_1: R19.1 R35.1 U9.4(Y)
NetR19_2: R19.2 R21.2 R22.2 U9.2(A)
NetR20_1: R20.1 R38.1 U12.7(DOUT+)
NetR20_2: R20.2 R35.2 R54.2 TP16.1 U12.2(DIN)
NetR40_1: R40.1 U12.8(DOUT-)

Not connected (* = marked no-connect by the designer): U9 1(NC)*; U12 3(NC)* 5(NC)* 6(NC)*

### Layout directives
mark named DIFF100: BUF_OUT_N, BUF_OUT_P
differential pair; differential pair class DIFF100_LINES; net class DIFF100: BUF_OUT_N, BUF_OUT_P

### Notes on the sheet
- Alternative configurations for LVDS termination.
- Single inverter gate
- (near U12) LVDS differential driver
- Project:
- Title
- File:
- Drawn by:
- Engineer:
- Checked by:
- Szymon Jedliński
- Sheet:
- Revision:
- Total Sheet:
- 1.0
- Variant:
- Approved by:
- Date:

### Library data of the parts
C33 = CC0603_1UF_16V_10%_X7R: as C1 on sheet Comparator; DesignItemId: CC0603_1UF_16V_10%_X7R; HelpURL: https://www.mouser.pl/datasheet/2/585/MLCC-1837944.pdf; Height: 0.8mm; SMD: Yes; Value: 1uF
C34 C40 = CC0603_100NF_16V_10%_X7R: as C2 on sheet Comparator; DesignItemId: CC0603_100NF_16V_10%_X7R; HelpURL: https://www.vishay.com/docs/28548/vjw1bcbascomseries.pdf; Height: 0.8mm; SMD: Yes; Value: 100nF
L5 L8 = FB0603_120R@100MHZ_2A: as L1 on sheet Comparator; DesignItemId: FB0603_120R@100MHZ_2A; HelpURL: https://www.tme.eu/Document/19a35c43258593752611d1c31a7dbf1a/MURATA-BLM18P.pdf; SMD: Yes; Value: 120R@100MHz
R19 R20 R36 R37 R41 R42 R54 = R0402_DNP: as R39 on sheet Main; DesignItemId: R0402_DNP; HelpURL: https://www.vishay.com/docs/20035/dcrcwe3.pdf; SMD: Yes; Value: DNP
R21 R35 R38 R40 = R0402_0R_JUMPER: as R5 on sheet Comparator; DesignItemId: R0402_0R_JUMPER; HelpURL: https://www.vishay.com/docs/20035/dcrcwe3.pdf; SMD: Yes; Value: 0R
R22 = R0402_49R9_0.0625W_100PPM: as R2 on sheet Comparator; DesignItemId: R0402_49R9_0.0625W_100PPM; HelpURL: https://www.mouser.pl/datasheet/2/447/PYu_RC_Group_51_RoHS_L_11-1984063.pdf; SMD: Yes; Value: 49R9
TP16 = TESTPOINT_SMD_C1P27MM: 1.27mm diameter SMD Test Point Area; DesignItemId: TESTPOINT_SMD_C1P27MM; Family: TestPoint; Part Description: 1.27mm diameter SMD Test Point Area
U9 = SN74LVC1G04MDBVREP: SINGLE INVERTER GATE; Manufacturer 1 Component Height: 1.45mm; DesignItemId: SN74LVC1G04MDBVREP; Device: SN74LVC1G04MDBVREP; HelpURL: https://www.ti.com/lit/ds/symlink/txs0108e.pdf?ts=1625042999829&ref_url=https%253A%252F%252Fwww.google.com%252F; Manufacturer 1 Example: SN74LVC1G04MDBVREP; Manufacturer 1 Part Number: SN74LVC1G04MDBVREP; SMD: Yes
U12 = ADN4661BRZ: ADN4661BRZ, Single, 3 V, CMOS, LVDS, High Speed Differential Driver; Manufacturer 1 Component Height: 1.75mm; DesignItemId: ADN4661BRZ; Device: ADN4661BRZ; HelpURL: https://www.analog.com/media/en/technical-documentation/data-sheets/ADN4661.pdf; Manufacturer Part Number: ADN4661BRZ; SMD: Yes

## Sheet Bipolar_Offset_Shifter.SchDoc
size A4; CompanyName: WEITI ISE; Address1: ul. Nowowiejska 15/19; Address2: 00-665 Warszawa; DocumentNumber: 5; SheetNumber: 5; SheetTotal: 11
Used 2 times, as channels U_Bipolar_offset_shifterA, U_Bipolar_offset_shifterB. Parts and nets are listed once, with the designators drawn on the sheet.
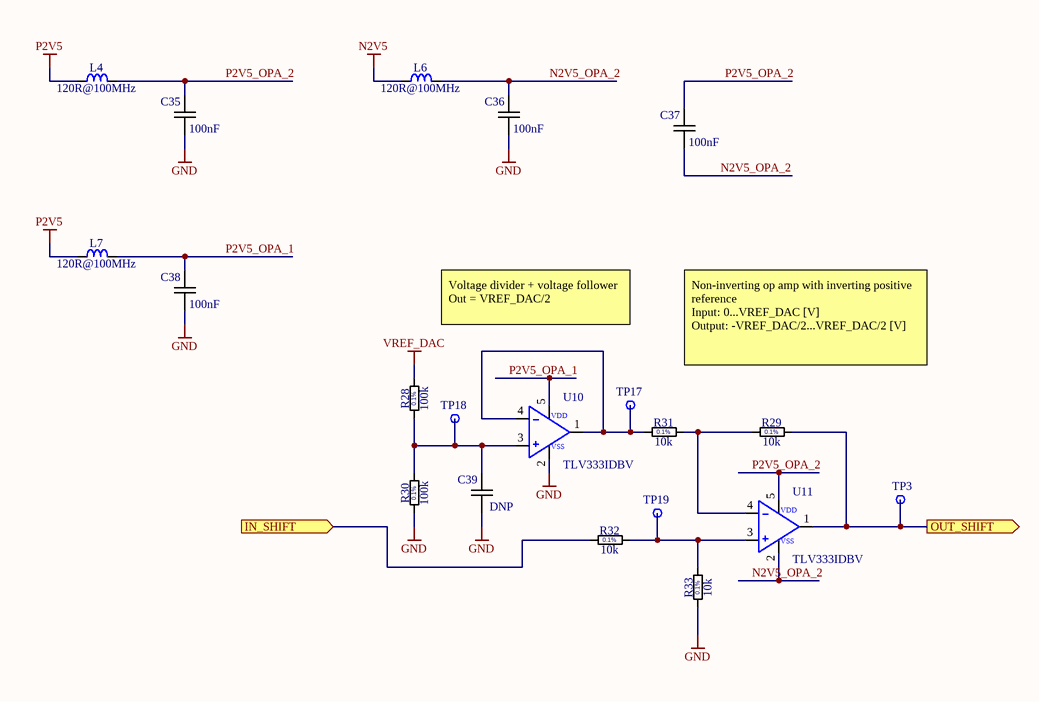
[diagram p9: Bipolar_Offset_Shifter.SchDoc]

### Parts
C35  100nF  [CAPC0603X90N]
C36  100nF  [CAPC0603X90N]
C37  100nF  [CAPC0603X90N]
C38  100nF  [CAPC0603X90N]
C39  DNP  [CAPC0603X90N]
L4  120R@100MHz  [INDC0603X90N]
L6  120R@100MHz  [INDC0603X90N]
L7  120R@100MHz  [INDC0603X90N]
R28  100k  [RESC0603X60N]
R29  10k  [RESC0603X60N]
R30  100k  [RESC0603X60N]
R31  10k  [RESC0603X60N]
R32  10k  [RESC0603X60N]
R33  10k  [RESC0603X60N]
TP3  TestPoint  [TESTPOINT_SMD_C1P27MM]  (value not drawn)  (no BOM)
TP17  TestPoint  [TESTPOINT_SMD_C1P27MM]  (value not drawn)  (no BOM)
TP18  TestPoint  [TESTPOINT_SMD_C1P27MM]  (value not drawn)  (no BOM)
TP19  TestPoint  [TESTPOINT_SMD_C1P27MM]  (value not drawn)  (no BOM)
U10  TLV333IDBV  [SOT23-5]
U11  TLV333IDBV  [SOT23-5]

### Ports
IN_SHIFT (in), OUT_SHIFT (out)

### Nets
GND: C35.2 C36.2 C38.2 C39.2 R30.1 R33.1 U10.2(VSS)
N2V5: L6.1
P2V5: L4.1 L7.1
VREF_DAC: R28.2
IN_SHIFT: R32.1 ; port IN_SHIFT
N2V5_OPA_2: C36.1 C37.2 L6.2 U11.2(VSS)
OUT_SHIFT: R29.2 TP3.1 U11.1 ; port OUT_SHIFT
P2V5_OPA_1: C38.1 L7.2 U10.5(VDD)
P2V5_OPA_2: C35.1 C37.1 L4.2 U11.5(VDD)
NetC39_1: C39.1 R28.1 R30.2 TP18.1 U10.3
NetR29_1: R29.1 R31.2 U11.4
NetR31_1: R31.1 TP17.1 U10.1 U10.4
NetR32_2: R32.2 R33.2 TP19.1 U11.3

### Channels
U_Bipolar_offset_shifterA: designators end in _1; ports IN_SHIFT=DAC_VOUT_A OUT_SHIFT=IN-
U_Bipolar_offset_shifterB: designators end in _2; ports IN_SHIFT=DAC_VOUT_B OUT_SHIFT=IN+

### Notes on the sheet
- Voltage divider + voltage follower
  Out = VREF_DAC/2
- Non-inverting op amp with inverting positive reference
  Input: 0...VREF_DAC [V]
  Output: -VREF_DAC/2...VREF_DAC/2 [V]
- Project:
- Title
- File:
- Drawn by:
- Engineer:
- Checked by:
- Szymon Jedliński
- Sheet:
- Revision:
- Total Sheet:
- 1.0
- Variant:
- Approved by:
- Date:
- (in symbol R0603_10k_0.1W_25PPM) 0.1%
- (in symbol R0603_100k_0.1W_25PPM) 0.1%

### Library data of the parts
C35-C38 = CC0603_100NF_16V_10%_X7R: as C2 on sheet Comparator; DesignItemId: CC0603_100NF_16V_10%_X7R; HelpURL: https://www.vishay.com/docs/28548/vjw1bcbascomseries.pdf; Height: 0.8mm; SMD: Yes; Value: 100nF
C39 = CC0603_DNP: as C14 on sheet Power_N2V5; DesignItemId: CC0603_DNP; Height: 0.8mm; SMD: Yes; Value: DNP
L4 L6 L7 = FB0603_120R@100MHZ_2A: as L1 on sheet Comparator; DesignItemId: FB0603_120R@100MHZ_2A; HelpURL: https://www.tme.eu/Document/19a35c43258593752611d1c31a7dbf1a/MURATA-BLM18P.pdf; SMD: Yes; Value: 120R@100MHz
R28 R30 = R0603_100k_0.1W_25PPM: General Purpose Thick Film Chip Resistor; Manufacturer Part Number: RT0603BRD07100KL; Manufacturer 1 Component Height: 0.45mm; Tolerance: 0.10%; Voltage: 75V; DesignItemId: R0603_100k_0.1W_25PPM; HelpURL: https://www.mouser.pl/datasheet/2/447/PYu_RT_1_to_0_01_RoHS_L_12-3003070.pdf; SMD: Yes; Value: 100k
R29 R31-R33 = R0603_10k_0.1W_25PPM: General Purpose Thick Film Chip Resistor; Manufacturer Part Number: RT0603BRD0710KL; Manufacturer 1 Component Height: 0.45mm; Tolerance: 0.10%; Voltage: 75V; DesignItemId: R0603_10k_0.1W_25PPM; HelpURL: https://www.mouser.pl/datasheet/2/447/PYu_RT_1_to_0_01_RoHS_L_12-3003070.pdf; SMD: Yes; Value: 10k
TP3 TP17-TP19 = TESTPOINT_SMD_C1P27MM: 1.27mm diameter SMD Test Point Area; DesignItemId: TESTPOINT_SMD_C1P27MM; Family: TestPoint; Part Description: 1.27mm diameter SMD Test Point Area
U10 U11 = TLV333IDBV: VS = 1.8 V (±0.9 V) up to 5.5 V (±2.75 V),  350kHz, 2-?V VOS, 0.02-?V/°C, 17-?A, , Zero-Drift Series; Manufacturer 1 Component Height: 1.1mm; DesignItemId: TLV333IDBV; Device: TLV333IDBV; HelpURL: https://www.ti.com/lit/ds/symlink/tlv333.pdf?ts=1691149914735&ref_url=https%253A%252F%252Fwww.ti.com%252Fproduct%252FTLV333; Manufacturer Part Number: TLV333IDBV; SMD: Yes

## Sheet Resistive_Unequal_Power_Divider.SchDoc
size A4; CompanyName: WEITI ISE; Address1: ul. Nowowiejska 15/19; Address2: 00-665 Warszawa; DocumentNumber: 6; SheetNumber: 6; SheetTotal: 11
Used 3 times, as channels U_Resistive_Unequal_Power_DividerB, U_Resistive_Unequal_Power_DividerA, U_Resistive_Unequal_Power_DividerC. Parts and nets are listed once, with the designators drawn on the sheet.
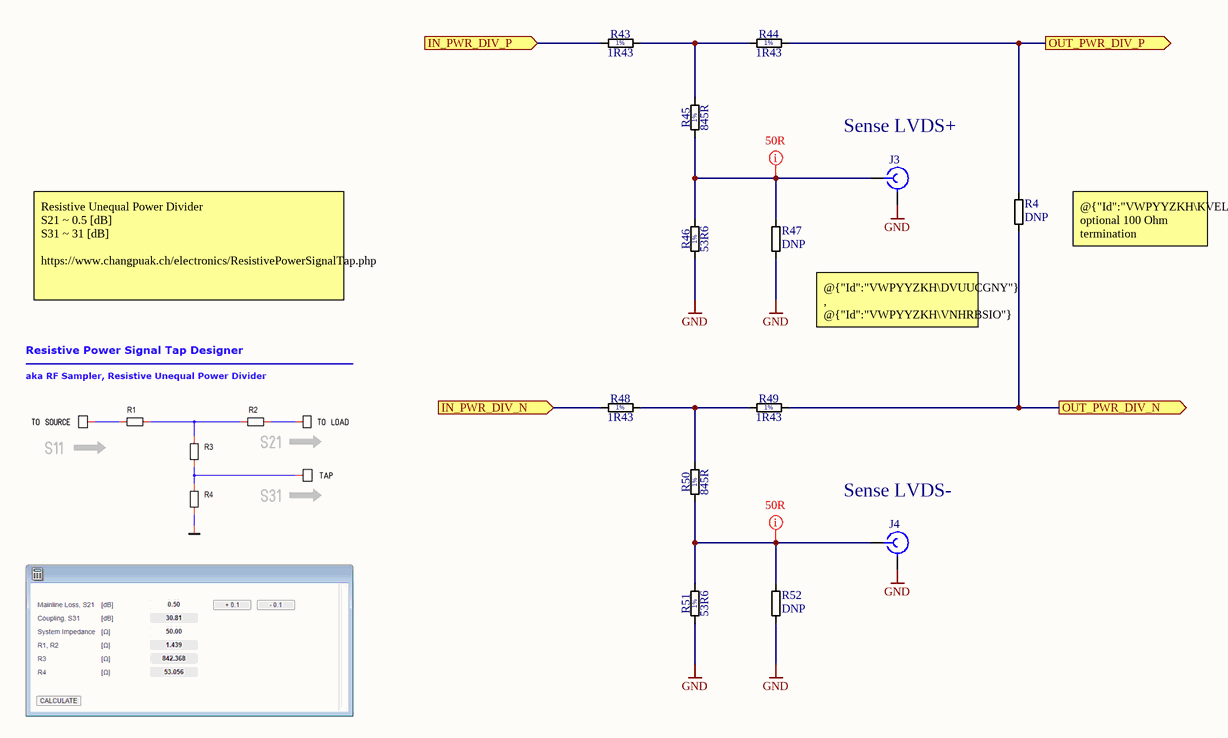
[diagram p10: Resistive_Unequal_Power_Divider.SchDoc]

### Parts
J3  901-144-8RFX  [901-144-8RFX]  (value not drawn)
J4  901-144-8RFX  [901-144-8RFX]  (value not drawn)
R4  DNP  [RESC0402X40N]
R43  1R43  [RESC0402X40N]
R44  1R43  [RESC0402X40N]
R45  845R  [RESC0402X40N]
R46  53R6  [RESC0402X40N]
R47  DNP  [RESC0402X40N]
R48  1R43  [RESC0402X40N]
R49  1R43  [RESC0402X40N]
R50  845R  [RESC0402X40N]
R51  53R6  [RESC0402X40N]
R52  DNP  [RESC0402X40N]

### Ports
IN_PWR_DIV_N (in), IN_PWR_DIV_P (in), OUT_PWR_DIV_N (out), OUT_PWR_DIV_P (out)

### Nets
GND: J3.2 J4.2 R46.1 R47.1 R51.1 R52.1
IN_PWR_DIV_N: R48.1 ; port IN_PWR_DIV_N
IN_PWR_DIV_P: R43.1 ; port IN_PWR_DIV_P
OUT_PWR_DIV_N: R4.1 R49.2 ; port OUT_PWR_DIV_N
OUT_PWR_DIV_P: R4.2 R44.2 ; port OUT_PWR_DIV_P
NetJ3_1: J3.1 R45.1 R46.2 R47.2
NetJ4_1: J4.1 R50.1 R51.2 R52.2
NetR43_2: R43.2 R44.1 R45.2
NetR48_2: R48.2 R49.1 R50.2

### Channels
U_Resistive_Unequal_Power_DividerB: designators end in _3#1; ports IN_PWR_DIV_N=COMP_OUT_N IN_PWR_DIV_P=COMP_OUT_P OUT_PWR_DIV_N=BUF_COMP2_OUT_N OUT_PWR_DIV_P=BUF_COMP2_OUT_P
U_Resistive_Unequal_Power_DividerA: designators end in _1; ports IN_PWR_DIV_N=COMP_OUT_N IN_PWR_DIV_P=COMP_OUT_P OUT_PWR_DIV_N=BUF_COMP1_OUT_N OUT_PWR_DIV_P=BUF_COMP1_OUT_P
U_Resistive_Unequal_Power_DividerC: designators end in _3#2; ports IN_PWR_DIV_N=BUF_OUT_N IN_PWR_DIV_P=BUF_OUT_P OUT_PWR_DIV_N=BUF_OUT_ZBRD_N OUT_PWR_DIV_P=BUF_OUT_ZBRD_P

### Layout directives
net class SE50; CompClassName: SE50_LINE: NetJ3_3#1_1, NetJ4_3#1_1

### Notes on the sheet
- (near J3) Sense LVDS+
- Resistive Unequal Power Divider
  S21 ~ 0.5 [dB]
  S31 ~ 31 [dB]
  https://www.changpuak.ch/electronics/ResistivePowerSignalTap.php
- @{"Id":"VWPYYZKH\KVELIYVL"} optional 100 Ohm termination
- @{"Id":"VWPYYZKH\DVUUCGNY"} , @{"Id":"VWPYYZKH\VNHRBSIO"} optional 50 Ohm termination
- (near J4) Sense LVDS-
- Project:
- Title
- File:
- Drawn by:
- Engineer:
- Checked by:
- Szymon Jedliński
- Sheet:
- Revision:
- Total Sheet:
- 1.0
- Variant:
- Approved by:
- Date:

### Library data of the parts
J3 J4 = 901-144-8RFX: Coaxial Connectors VERTICAL PCB JACK GOLD PLATED BRASS; Manufacturer 1 Component Height: 9.53mm; DesignItemId: 901-144-8RFX; HelpURL: https://www.mouser.pl/datasheet/2/18/1/amph_s_a0001295158_1-2260876.pdf; Manufacturer Part Number: 901-144-8RFX; SMD: No
R4 R47 R52 = R0402_DNP: as R39 on sheet Main; DesignItemId: R0402_DNP; HelpURL: https://www.vishay.com/docs/20035/dcrcwe3.pdf; SMD: Yes; Value: DNP
R43 R44 R48 R49 = R0402_1R43_0.0625W_100PPM: General Purpose Thick Film Chip Resistor; Manufacturer Part Number: CRCW04021R43FKED; Manufacturer 1 Component Height: 0.4mm; Tolerance: 1%; Voltage: 50V; DesignItemId: R0402_1R43_0.0625W_100PPM; HelpURL: https://www.vishay.com/docs/20035/dcrcwe3.pdf; SMD: Yes; Value: 1R43
R45 R50 = R0402_845R_0.0625W_100PPM: General Purpose Thick Film Chip Resistor; Manufacturer Part Number: RC0402FR-07845RL; Manufacturer 1 Component Height: 0.4mm; Tolerance: 1%; Voltage: 50V; DesignItemId: R0402_845R_0.0625W_100PPM; HelpURL: https://www.mouser.pl/datasheet/2/447/PYu_RC_Group_51_RoHS_L_11-1984063.pdf; SMD: Yes; Value: 845R
R46 R51 = R0402_53R6_0.0625W_100PPM: General Purpose Thick Film Chip Resistor; Manufacturer Part Number: RC0402FR-0753R6L; Manufacturer 1 Component Height: 0.4mm; Tolerance: 1%; Voltage: 50V; DesignItemId: R0402_53R6_0.0625W_100PPM; HelpURL: https://www.mouser.pl/datasheet/2/447/PYu_RC_Group_51_RoHS_L_11-1984063.pdf; SMD: Yes; Value: 53R6

## Nets that join several sheets
GND: Main (13 pins), U_ComparatorA (11 pins), U_ComparatorB (11 pins), Power_Supply (5 pins), Power_P2V5 (6 pins), Power_N2V5 (12 pins), Power_P3V3 (8 pins), Power_VREF_P1V25 (8 pins), DAC (C30.2 C31.2 C32.2 U6.3), External_Trigger_Buffer (9 pins), U_Bipolar_offset_shifterA (7 pins), U_Bipolar_offset_shifterB (7 pins), U_Resistive_Unequal_Power_DividerB (6 pins), U_Resistive_Unequal_Power_DividerA (6 pins), U_Resistive_Unequal_Power_DividerC (6 pins)
N2V5: U_ComparatorA (L2_1.1), U_ComparatorB (L2_2.1), Power_N2V5 (7 pins), U_Bipolar_offset_shifterA (L6_1.1), U_Bipolar_offset_shifterB (L6_2.1)
P2V5: U_ComparatorA (L1_1.1 R1_1.2 R3_1.2), U_ComparatorB (L1_2.1 R1_2.2 R3_2.2), Power_P2V5 (5 pins), External_Trigger_Buffer (R36.2 R37.2), U_Bipolar_offset_shifterA (L4_1.1 L7_1.1), U_Bipolar_offset_shifterB (L4_2.1 L7_2.1)
P3V3: Power_P3V3 (7 pins), Power_VREF_P1V25 (C26.1 C27.1 U8.2 U8.3), DAC (L3.1 R15.2 R16.2), External_Trigger_Buffer (L5.1 L8.1)
P5V0: Power_Supply (R23.2 T3.3 U13.6), Power_P2V5 (C17.1 C18.1 U3.1 U3.3), Power_N2V5 (C7.1 C8.1 U4.3 U4.4), Power_P3V3 (5 pins)
VREF_DAC: DAC (C32.1 R27.2 TP10.1 U6.10), U_Bipolar_offset_shifterA (R28_1.2), U_Bipolar_offset_shifterB (R28_2.2)
VREF_P1V25: Power_VREF_P1V25 (C28.1 C29.1 TP8.1 U8.6), DAC (R27.1)
BUF_COMP1_OUT_N: Main (P2.10), U_Resistive_Unequal_Power_DividerA (R4_1.1 R49_1.2)
BUF_COMP1_OUT_P: Main (P2.12), U_Resistive_Unequal_Power_DividerA (R4_1.2 R44_1.2)
BUF_COMP2_OUT_N: Main (P2.6), U_Resistive_Unequal_Power_DividerB (R4_3#1.1 R49_3#1.2)
BUF_COMP2_OUT_P: Main (P2.8), U_Resistive_Unequal_Power_DividerB (R4_3#1.2 R44_3#1.2)
BUF_IN: Main (J2.1), External_Trigger_Buffer (R21.1)
BUF_OUT_N: External_Trigger_Buffer (R37.1 R40.2 R42.2), U_Resistive_Unequal_Power_DividerC (R48_3#2.1)
BUF_OUT_P: External_Trigger_Buffer (R36.1 R38.2 R41.2), U_Resistive_Unequal_Power_DividerC (R43_3#2.1)
BUF_OUT_ZBRD_N: Main (P2.9), U_Resistive_Unequal_Power_DividerC (R4_3#2.1 R49_3#2.2)
BUF_OUT_ZBRD_P: Main (P2.11), U_Resistive_Unequal_Power_DividerC (R4_3#2.2 R44_3#2.2)
CLR_ZBRD: Main (P3.12), DAC (R18.1)
COMP_OUT_N: U_ComparatorA (R3_1.1 R6_1.2 R8_1.2), U_Resistive_Unequal_Power_DividerA (R48_1.1)
COMP_OUT_N: U_ComparatorB (R3_2.1 R6_2.2 R8_2.2), U_Resistive_Unequal_Power_DividerB (R48_3#1.1)
COMP_OUT_P: U_ComparatorA (R1_1.1 R5_1.2 R7_1.2), U_Resistive_Unequal_Power_DividerA (R43_1.1)
COMP_OUT_P: U_ComparatorB (R1_2.1 R5_2.2 R7_2.2), U_Resistive_Unequal_Power_DividerB (R43_3#1.1)
DAC_VOUT_A: DAC (TP1.1 U6.1), U_Bipolar_offset_shifterA (R32_1.1)
DAC_VOUT_B: DAC (TP2.1 U6.2), U_Bipolar_offset_shifterB (R32_2.1)
DIN_ZBRD: Main (P3.5), DAC (R14.1)
IN+: Main (R39.1 U1.2), U_ComparatorA (R2_1.2 U2_1.5)
IN+: U_ComparatorB (R2_2.2 U2_2.5), U_Bipolar_offset_shifterB (R29_2.2 TP3_2.1 U11_2.1)
IN-: Main (R53.2 U1.3), U_ComparatorB (R34_2.2 U2_2.4)
IN-: U_ComparatorA (R34_1.2 U2_1.4), U_Bipolar_offset_shifterA (R29_1.2 TP3_1.1 U11_1.1)
LDAC_ZBRD: Main (P3.10), DAC (R17.1)
SCLK_ZBRD: Main (P3.6), DAC (R13.1)
SYNC_ZBRD: Main (P3.8), DAC (R12.1)

## Assembly variants
Basic Assembly: not fitted C14 C25 C39_1 C39_2 R1_1 R1_2 R2_2 R3_1 R3_2 R4_1 R4_2 R4_3 R7_1 R7_2 R8_1 R8_2 R9 R10 R11 R19 R19 R20 R34_1 R35 R36 R37 R39 R39 R41 R42 R47_1 R47_2 R47_3 R52_1 R52_2 R52_3 R53 R?